# EAGLE schematic auduino (EAGLE 6.0)
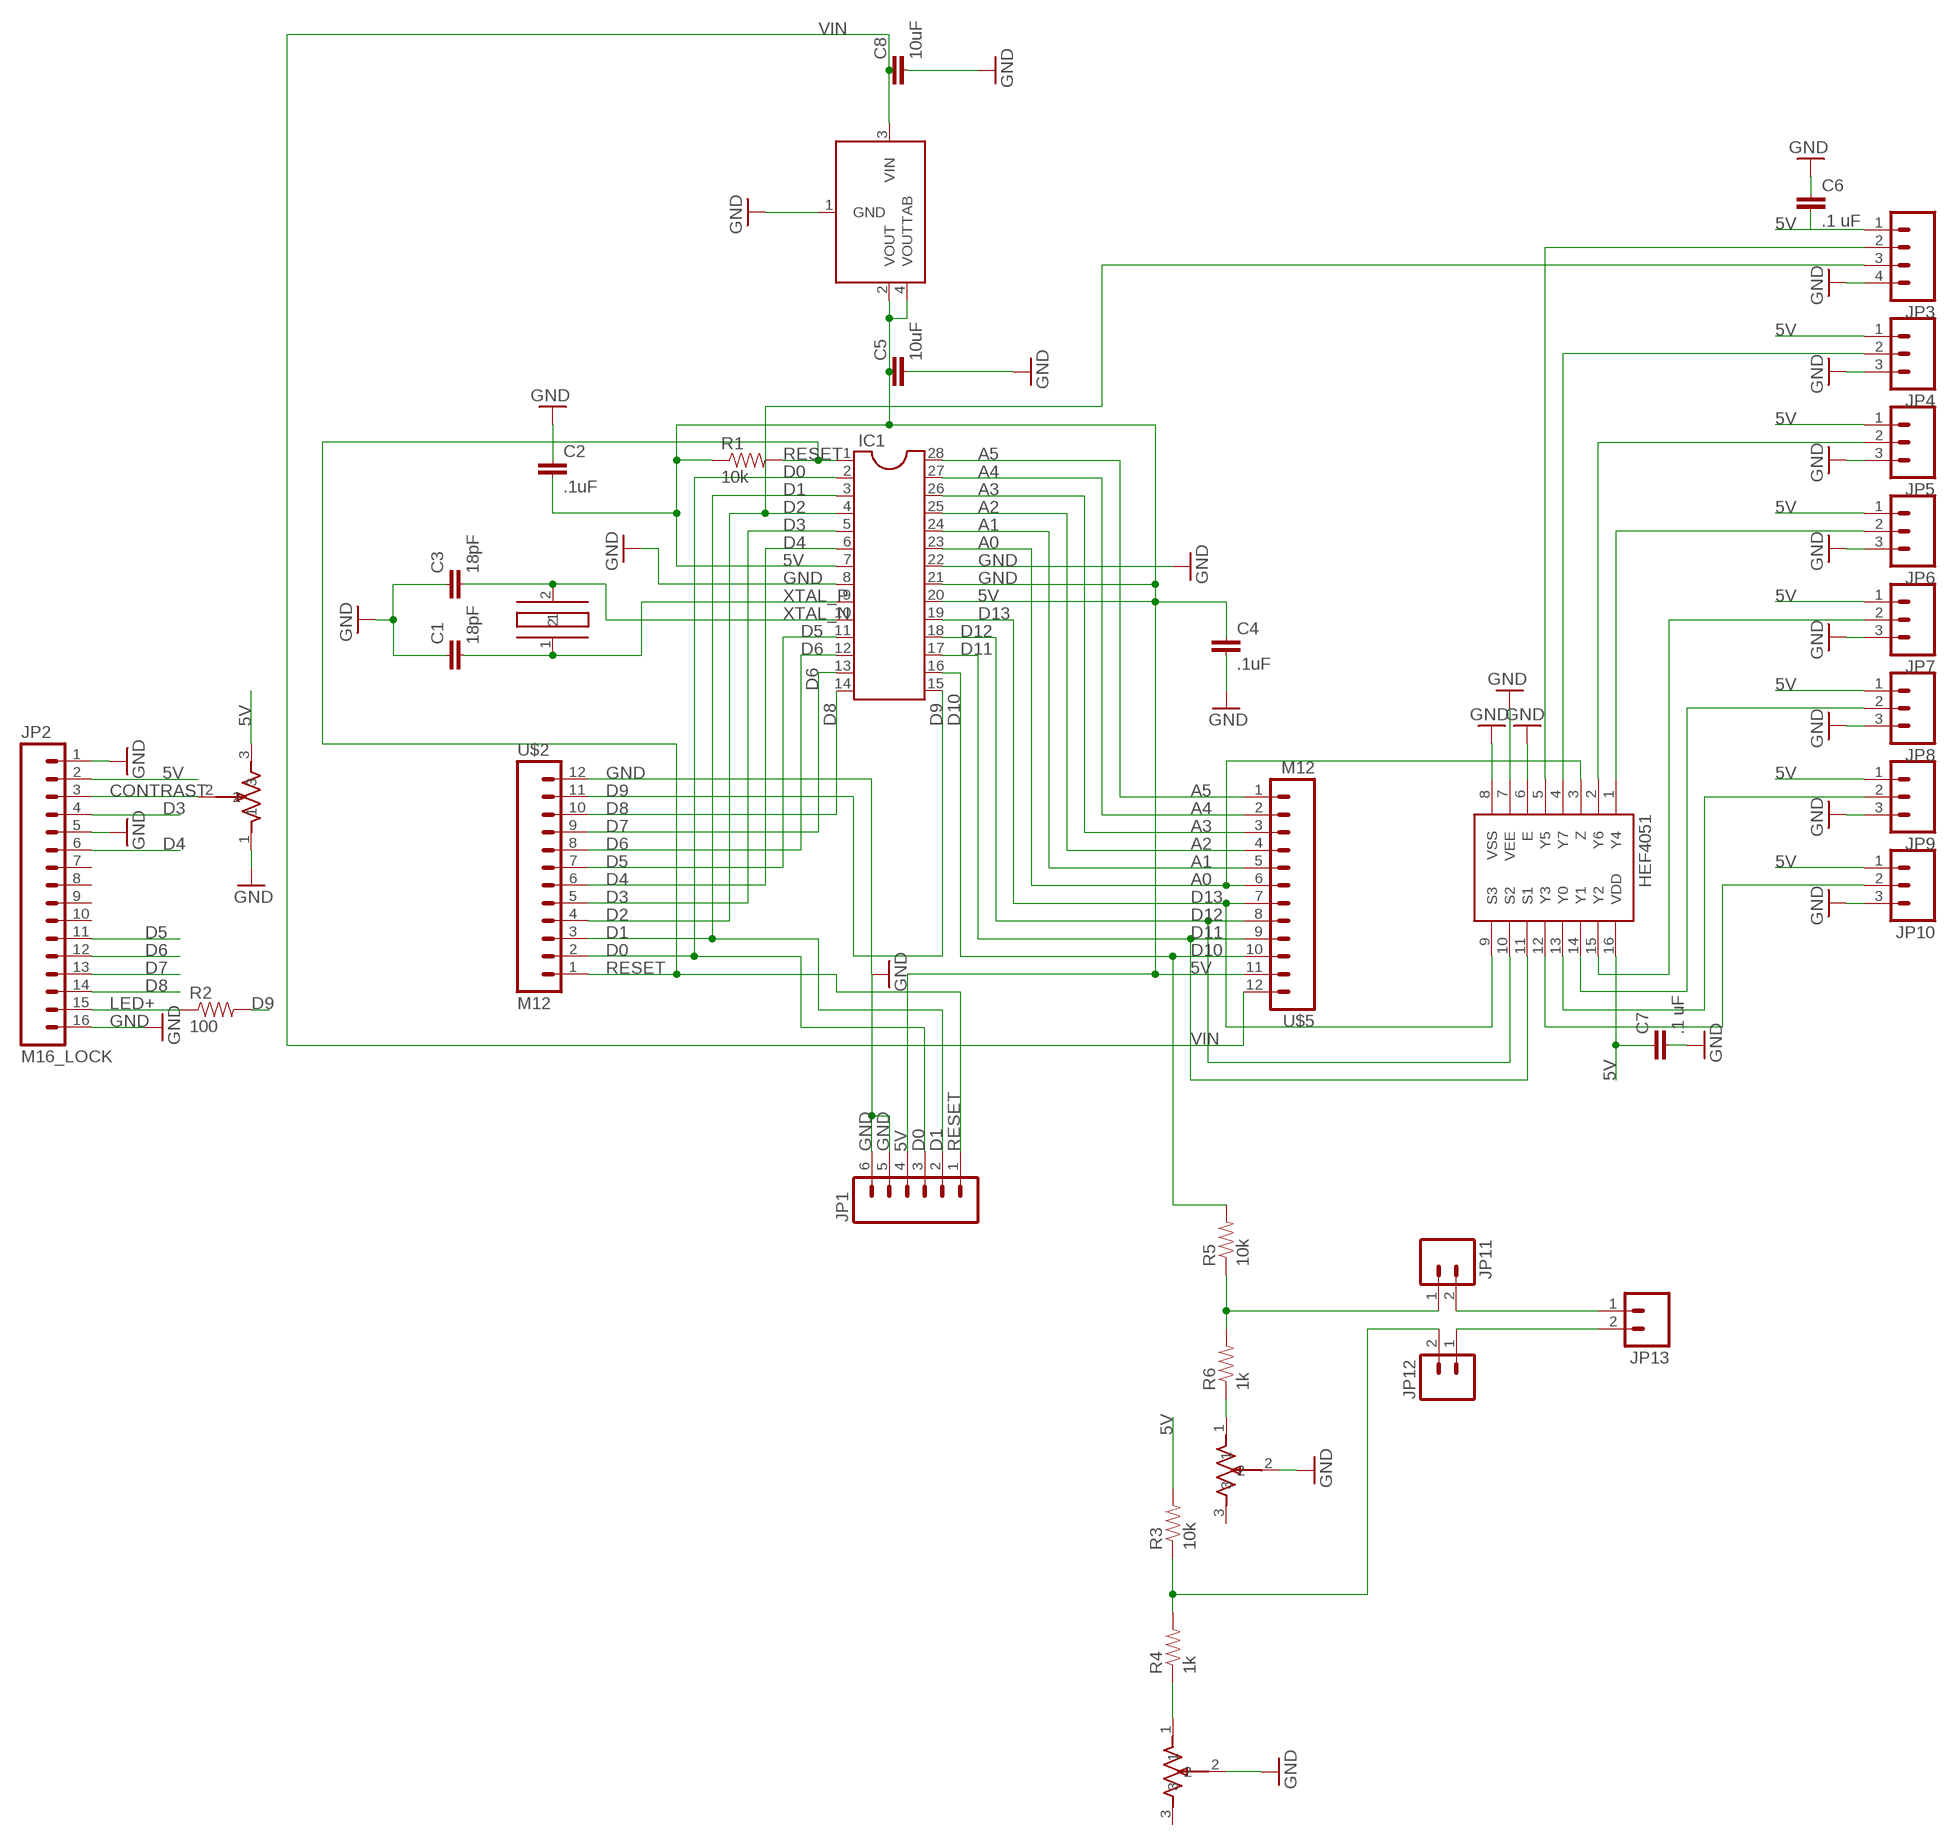
[diagram p0: schematic, sheet 1]

## Parts
5V  ZLDO1117  [ZLDO1117]
C1  18pF  CAP0603-CAP  [0603-CAP]
C2  .1uF  CAP0805  [0805]
C3  18pF  CAP0603-CAP  [0603-CAP]
C4  .1uF  CAP0805  [0805]
C5  10uF  CAP1206  [1206]
C6  .1 uF  CAP0805  [0805]
C7  .1 uF  CAP0805  [0805]
C8  10uF  CAP1206  [1206]
IC1  DIL28-3  [DIL28-3]
JP1  M06LOCK  [1X06_LOCK]
JP2  M16_LOCK  [1X16_LOCK]
JP3  M04LOCK  [1X04_LOCK]
JP4  M03LOCK  [1X03_LOCK]
JP5  M03LOCK  [1X03_LOCK]
JP6  M03LOCK  [1X03_LOCK]
JP7  M03LOCK  [1X03_LOCK]
JP8  M03LOCK  [1X03_LOCK]
JP9  M03LOCK  [1X03_LOCK]
JP10  M03LOCK  [1X03_LOCK]
JP11  M02LOCK  [1X02_LOCK]
JP12  M02LOCK  [1X02_LOCK]
JP13  M02LOCK  [1X02_LOCK]
R1  10k  RESISTOR  [0805]
R2  100  RESISTOR  [0805]
R3  10k  RESISTOR  [0805]
R4  1k  RESISTOR  [0805]
R5  10k  RESISTOR  [0805]
R6  1k  RESISTOR  [0805]
U$1  HC49US  [HC49US]
U$2  M12  M12LOCK  [1X12_LOCK]
U$3  TRIMPOTTC33X-2  [TC33X-2]
U$4  NXP|HEF4051BTD  [SO16]
U$5  M12  M12LOCK  [1X12_LOCK]
U$6  TRIMPOTTC33X-2  [TC33X-2]
U$7  TRIMPOTTC33X-2  [TC33X-2]

## Nets
0V5: JP12.2 R3.1 R4.2
1/10: JP11.1 R5.1 R6.2
5V: 5V.2(VOUT) 5V.4(VOUTTAB) C2.2 C4.1 C5.1 C6.2 C7.1 IC1.7 IC1.20 IC1.21 JP1.4 JP2.2 JP3.1 JP4.1 JP5.1 JP6.1 JP7.1 JP8.1 JP9.1 JP10.1 R1.1 R3.2 U$3.3 U$4.16(VDD) U$5.11
A0: IC1.23 U$4.3(Z) U$5.6
A1: IC1.24 U$5.5
A2: IC1.25 U$5.4
A3: IC1.26 U$5.3
A4: IC1.27 U$5.2
A5: IC1.28 U$5.1
CONTRAST: JP2.3 U$3.2
D0: IC1.2 JP1.3 U$2.2
D1: IC1.3 JP1.2 U$2.3
D2: IC1.4 JP3.3 U$2.4
D3: IC1.5 JP2.4 U$2.5
D4: IC1.6 JP2.6 U$2.6
D5: IC1.11 JP2.11 U$2.7
D6: IC1.12 JP2.12 U$2.8
D7: IC1.13 JP2.13 U$2.9
D8: IC1.14 JP2.14 U$2.10
D9: IC1.15 R2.2 U$2.11
D10: IC1.16 R5.2 U$5.10
D11: IC1.17 U$4.11(S1) U$5.9
D12: IC1.18 U$4.10(S2) U$5.8
D13: IC1.19 U$4.9(S3) U$5.7
GND: 5V.1(GND) C1.1 C2.1 C3.1 C4.2 C5.2 C6.1 C7.2 C8.2 IC1.8 IC1.22 JP1.5 JP1.6 JP2.1 JP2.5 JP2.16 JP3.4 JP4.3 JP5.3 JP6.3 JP7.3 JP8.3 JP9.3 JP10.3 U$2.12 U$3.1 U$4.6(E) U$4.7(VEE) U$4.8(VSS) U$6.2 U$7.2
LED+: JP2.15 R2.1
N$1: R6.1 U$7.1
N$2: JP3.2 U$4.5(Y5)
N$3: JP4.2 U$4.4(Y7)
N$4: JP5.2 U$4.2(Y6)
N$5: JP6.2 U$4.1(Y4)
N$6: JP7.2 U$4.15(Y2)
N$7: JP8.2 U$4.14(Y1)
N$8: JP9.2 U$4.13(Y0)
N$9: JP10.2 U$4.12(Y3)
N$10: R4.1 U$6.1
N$11: JP12.1 JP13.2
N$12: JP11.2 JP13.1
RESET: IC1.1 JP1.1 R1.2 U$2.1
VIN: 5V.3(VIN) C8.1 U$5.12
XTAL_N: C3.2 IC1.10 U$1.2
XTAL_P: C1.2 IC1.9 U$1.1
Unconnected: JP2.7 JP2.8 JP2.9 JP2.10 U$6.3 U$7.3

## Library data of the parts
5V = 1dah:ZLDO1117
C1-C8 = 1dah:CAP: Capacitor Standard 0402 ceramic capacitor, and 0.1" leaded capacitor.
IC1 = 1dah:DIL28: Dual In Line
JP1 = 1dah:M06: Header 6 Standard 6-pin 0.1" header. Use with straight break away headers (SKU : PRT-00116), right angle break away headers (PRT-00553), swiss pins (PRT-00743), machine pins (PRT-00117), and female headers (PRT-00115). Molex polarized connector foot print use with SKU : PRT-08094 with associated crimp pins and housings. NOTES ON THE VARIANTS LOCK and LOCK_LONGPADS... This footprint was designed to help hold the alignment of a through-hole component (i.e. 6-pin header) while soldering it into place. You may notice that each hole has been shifted either up or down by 0.005 of an inch from it's more standard position (which is a perfectly straight line). This slight alteration caused the pins (the squares in the middle) to touch the edges of the holes. Because they are alternating, it causes a "brace" to hold the component in place. 0.005 has proven to be the perfect amount of "off-center" position when using our standard breakaway headers. Although looks a little odd when you look at the bare footprint, once you have a header in there, the alteration is very hard to notice. Also, if you push a header all the way into place, it is covered up entirely on the bottom side. This idea of altering the position of holes to aid alignment will be further integrated into the Sparkfun Library for other footprints. It can help hold any component with 3 or more connection pins.
JP2 = 1dah:M16: Header 16 Standard 16-pin 0.1" header.
JP3 = 1dah:M04: Header 4 Standard 4-pin 0.1" header. Use with straight break away headers (SKU : PRT-00116), right angle break away headers (PRT-00553), swiss pins (PRT-00743), machine pins (PRT-00117), and female headers (PRT-00115). Molex polarized connector foot print use with SKU : PRT-08231 with associated crimp pins and housings.
JP4-JP10 = 1dah:M03: Header 3 Standard 3-pin 0.1" header. Use with straight break away headers (SKU : PRT-00116), right angle break away headers (PRT-00553), swiss pins (PRT-00743), machine pins (PRT-00117), and female headers (PRT-00115). Molex polarized connector foot print use with SKU : PRT-08232 with associated crimp pins and housings.
JP11-JP13 = 1dah:M02: Header 2 Standard 2-pin 0.1" header. Use with straight break away headers (SKU : PRT-00116), right angle break away headers (PRT-00553), swiss pins (PRT-00743), machine pins (PRT-00117), and female headers (PRT-00115). Molex polarized connector foot print use with SKU : PRT-08233 with associated crimp pins and housings.
R1-R6 = 1dah:RESISTOR: Resistor Basic schematic elements and footprints for 0603, 1206, and PTH 1/10th watt (small) resistors.
U$1 = 1dah:HC49US: 16 MHz crystal
U$2 U$5 = 1dah:M12: Header 12 Standard 12-pin 0.1" header. Use with straight break away headers (SKU : PRT-00116), right angle break away headers (PRT-00553), swiss pins (PRT-00743), machine pins (PRT-00117), and female headers (PRT-00115).
U$3 U$6 U$7 = 1dah:TRIMPOT: Bournes Trimpot
U$4 = 1dah:NXP|HEF4051BTD: 8:1 MUX/DMUX